# EAGLE design 12V - 5V Buck (1A) - LM3485 v2 (EAGLE 6.5.0)
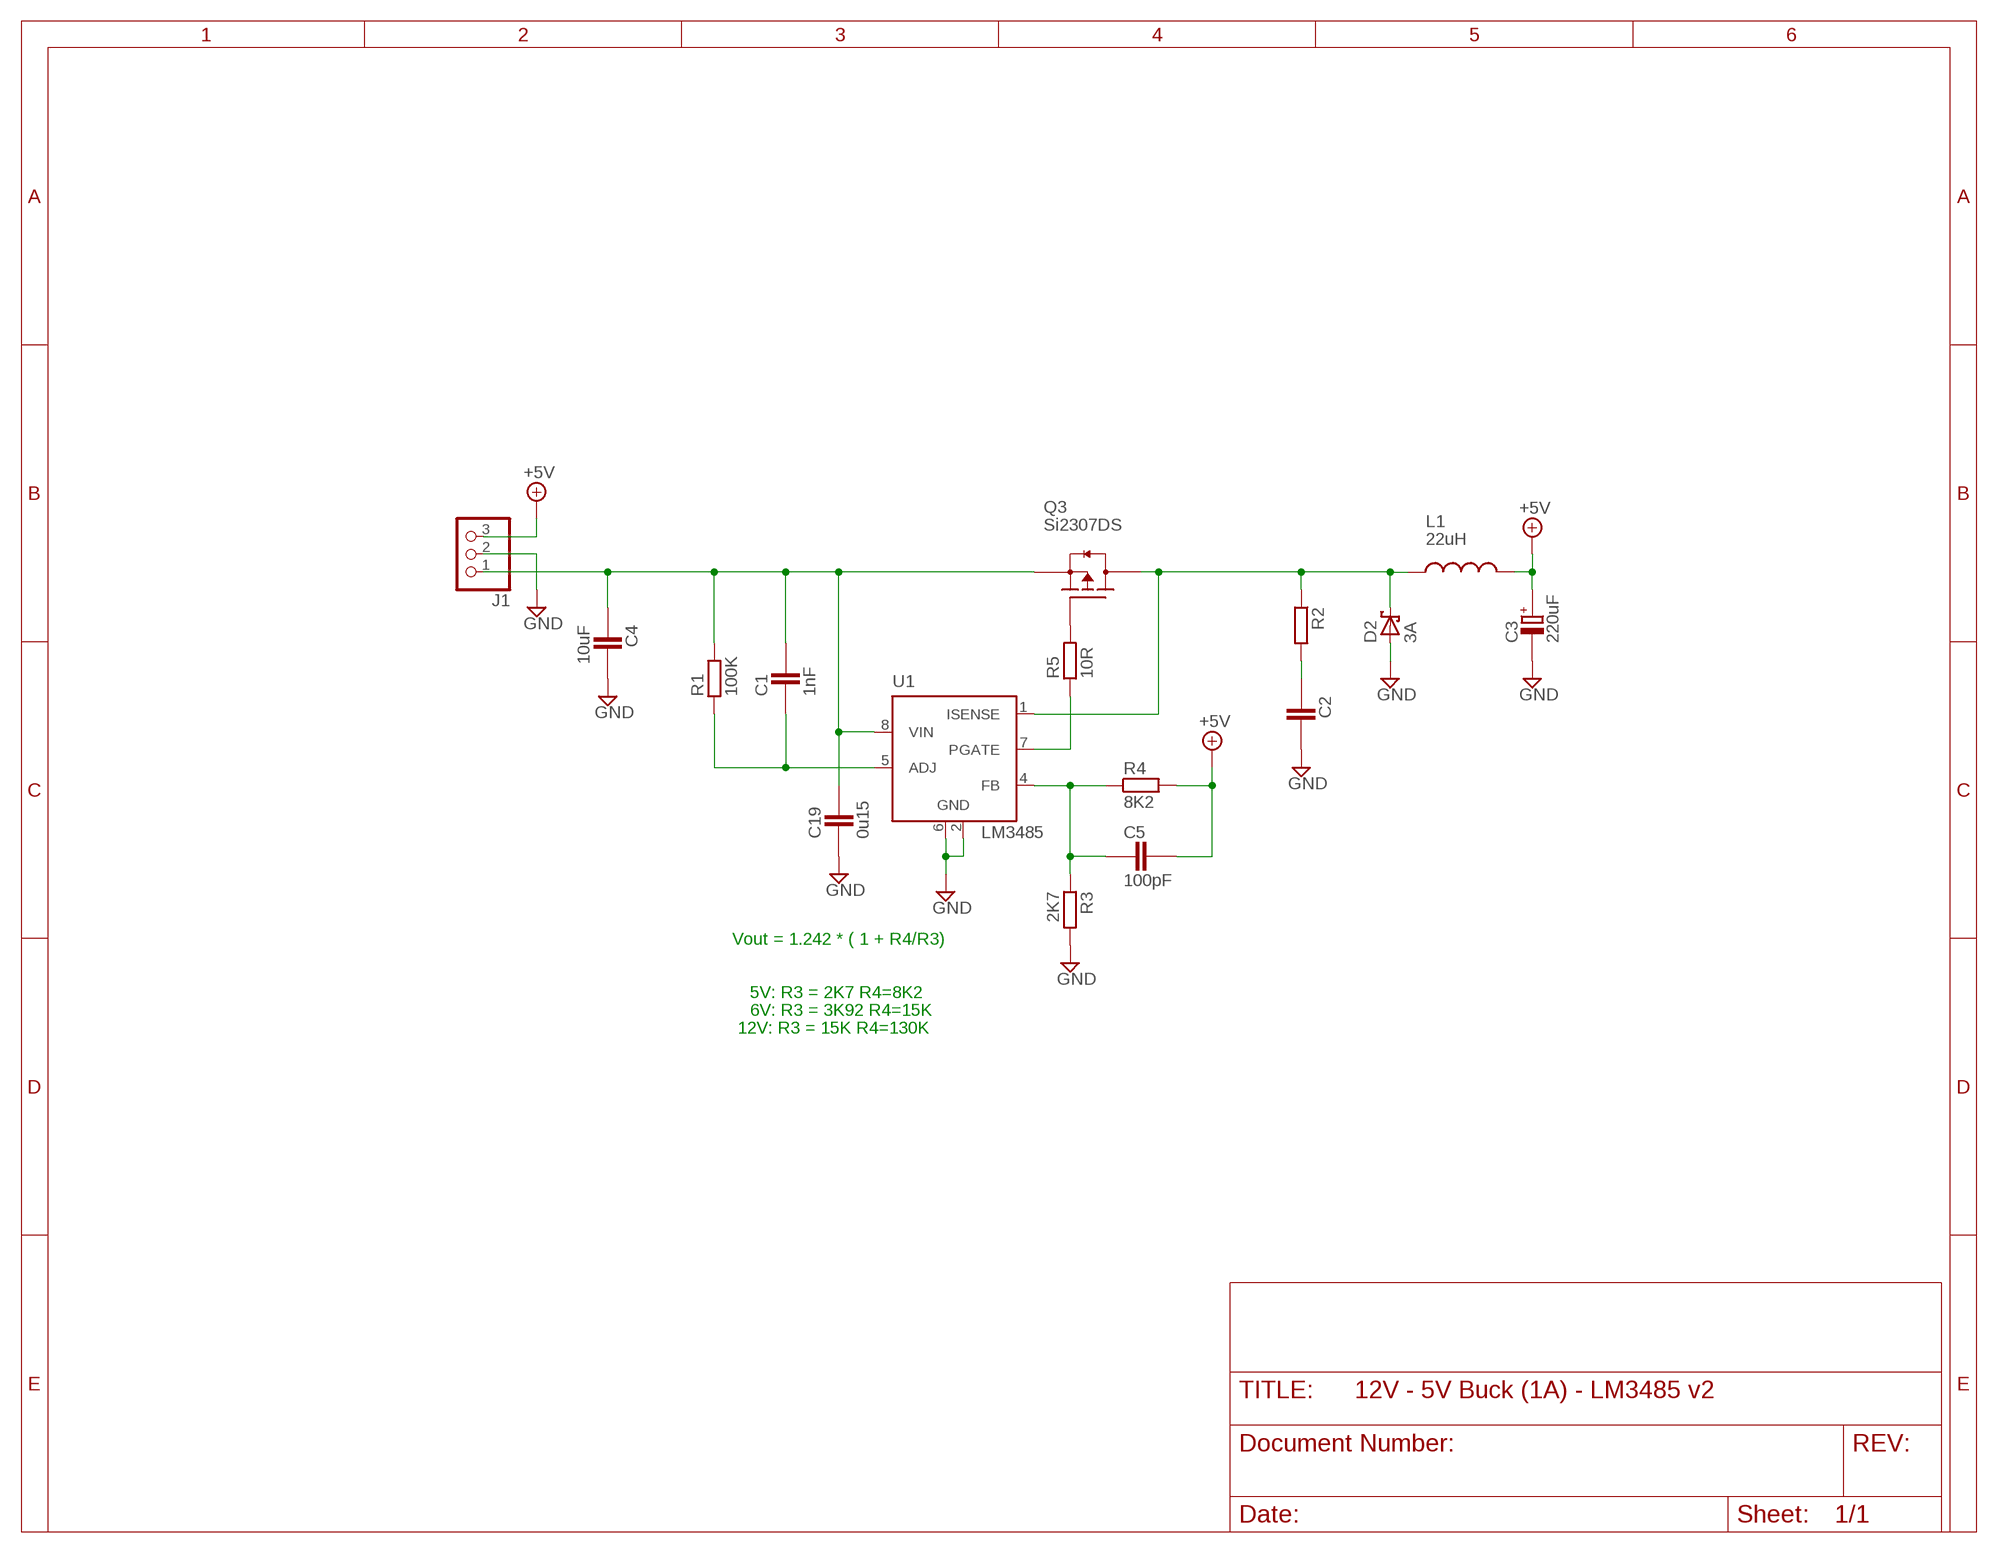
[diagram p0: schematic, sheet 1]

## Parts
C1  1nF  CAPACITOR_0805N  [CAP2012X70N]
C2  CAPACITOR_0805N  [CAP2012X70N]
C3  220uF  POLARISED_D_CASE  [CAPMP7343X310N]
C4  10uF  CAPACITOR_1210  [CAPC3225X168N]
C5  100pF  CAPACITOR_0805N  [CAP2012X70N]
C19  0u15  CAPACITOR_0603  [CAPC1608X92N]
D2  3A  SCHOTTKY_SMC  [DIOM7959X265N]
J1  PINHD-1X3  [1X03]
L1  22uH  DO3316P  [DO3316P]
Q3  Si2307DS  MOSFET-PCH_SOT-23  [SOT95P280X135-3N]
R1  100K  RESISTOR_0603  [RESC1608X55N]
R2  RESISTOR_0603  [RESC1608X55N]
R3  2K7  RESISTOR_0805  [RESC2012X70N]
R4  8K2  RESISTOR_0805  [RESC2012X70N]
R5  10R  RESISTOR_0603  [RESC1608X55N]
U1  LM3485  [MSOP08]

## Nets
+5V: C3.+ C5.2 J1.3 L1.2 R4.2
+12V: C1.2 C4.1 C19.2 J1.1 Q3.2(S) R1.2 U1.8(VIN)
GND: C2.2 C3.- C4.2 C19.1 D2.A J1.2 R3.2 U1.2(GND) U1.6(GND)
N$1: C5.1 R3.1 R4.1 U1.4(FB)
N$2: R5.1 U1.7(PGATE)
N$3: C1.1 R1.1 U1.5(ADJ)
N$4: C2.1 R2.2
N$6: Q3.1(G) R5.2
VO-L: D2.K L1.1 Q3.3(D) R2.1 U1.1(ISENSE)

## Notes on the sheet
- Vout = 1.242 * ( 1 + R4/R3)
- 5V: R3 = 2K7 R4=8K2
- 6V: R3 = 3K92 R4=15K
- 12V: R3 = 15K R4=130K

## Library data of the parts
C1 C2 C4 C5 C19 = ipc-7351-capacitor:CAPACITOR_
C3 = ipc-7351-capacitor:POLARISED_
D2 = ipc-7351-diode:SCHOTTKY_
J1 = Misc Conn:PINHD-1X3: PIN HEADER
L1 = Misc Inductors:DO3316P: COILCRAFT
Q3 = ipc-7351-transistor:MOSFET-PCH_
R1-R5 = ipc-7351-resistor:RESISTOR_
U1 = linear:LM3485: Hysteretic PFET Buck Controller Source: http://cache.national.com/ds/LM/LM3485.pdf

## Board
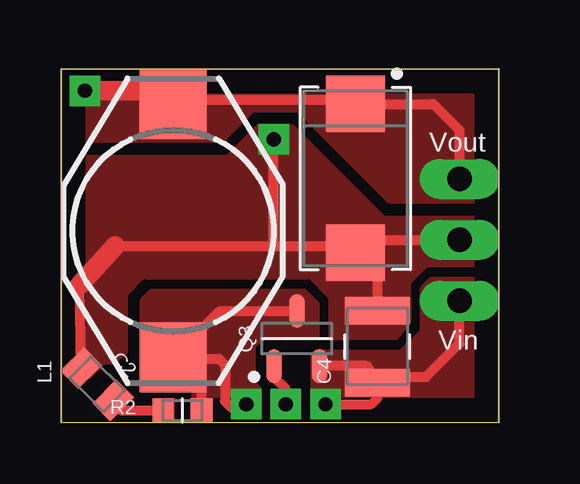
[diagram p1: board, top side]
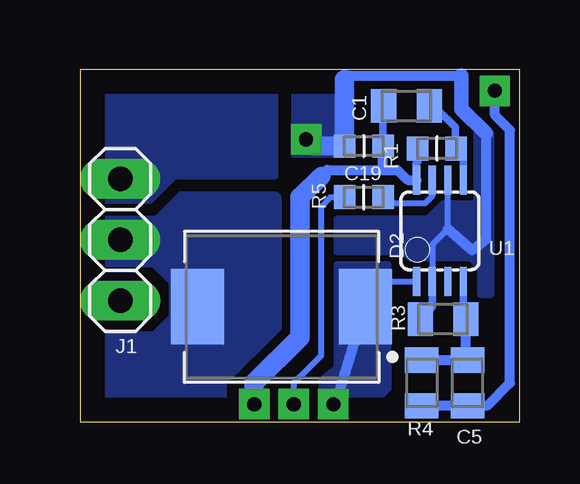
[diagram p2: board, bottom side, seen from below]

Size 18.29 x 14.73 mm. Coordinates in mm from the lower left corner, seen from the top.
Outline: 0,0 18.29,0 18.29,14.73 0,14.73 0,0
Copper layers (1*16): Top 0.035mm / dielectric 1.5mm / Bottom 0.035mm
Design rules "default": minimum track width 10mil, minimum drill 24mil, track to track 8mil, track to pad 8mil, pad to pad 8mil, via to via 8mil, smd to smd 8mil, copper to edge 40mil, drill to drill 8mil, minimum pad ring 10mil, minimum via ring 8mil, stop-mask expansion 4mil, vias tented up to drill 0mil, thermal gap 10mil

### Footprints (pad centres in the part's own frame; a part is rotated, then mirrored left to right if it is on the bottom)
CAP2012X70N = smd 1.05 x 1.4: 1 -0.95,0; 2 0.95,0
CAPMP7343X310N = smd 2.35 x 2.45: + -3.1,0; - 3.1,0
CAPC3225X168N = smd 1.15 x 2.7: 1 -1.5,0; 2 1.5,0
CAPC1608X92N = smd 0.9 x 0.95: 1 -0.8,0; 2 0.8,0
DIOM7959X265N = smd 2.2 x 3.15: A 3.5,0; K -3.5,0
1X03 = drill 1.016 pad 1.676 long: 1 -2.54,0; 2 0,0; 3 2.54,0
DO3316P = smd 2.92 x 2.79: 1 -5.28,0; 2 5.28,0
SOT95P280X135-3N = smd 1.4 x 0.65: 1 -1.15,0.95; 2 -1.15,-0.95; 3 1.15,0
RESC1608X55N = smd 0.9 x 1: 1 -0.8,0; 2 0.8,0
RESC2012X70N = smd 1.05 x 1.4: 1 -0.95,0; 2 0.95,0
MSOP08 = smd 0.3 x 1.2: 1 -0.976,-2.113; 2 -0.326,-2.113; 3 0.324,-2.113; 4 0.974,-2.113; 5 0.974,2.112; 6 0.324,2.112; 7 -0.326,2.112; 8 -0.976,2.112

### Placement (x,y rotation side)
C1  4.7,13.2 180 bottom
C2  1.52,1.6 135 top
C3  12.29,10.18 270 top
C4  13.21,3.17 90 top
C5  2.16,1.65 270 bottom
C19  6.48,11.53 0 bottom
D2  9.91,4.82 180 bottom
J1  16.64,7.61 90 bottom
L1  4.7,8 90 top
Q3  9.86,3.5 90 top
R1  3.43,11.42 180 bottom
R2  5.08,0.5 180 top
R3  3.17,4.31 180 bottom
R4  4.06,1.65 270 bottom
R5  6.48,9.39 180 bottom
U1  3.3,8 0 bottom

### Tracks (layer width: path | path; a pad name or v marks a point on that pad's centre or on a via)
+5V  (via drill 0.6 pad 1.27)
  Top 0.254: 4.83,13.46 4.64,13.46 4.64,13.84
  Top 0.406: L1.2 4.77,13.4 4.83,13.46 11.45,13.46 C3.+ 15.54,13.28 16.64,12.19 J1.3
  Top 0.813: v1.02,13.84 4.64,13.84
  Bottom 0.406: v1.02,13.84 1.02,12.82 0.38,12.19 0.38,1.65 1.33,0.7 C5.2 R4.2
  pour Top (no thermals): 0.13,14.6 0.13,11.81 6.73,11.81 8,13.08 9.91,13.08 13.72,9.27 17.78,9.27 18.16,9.65 18.16,14.6
  pour Bottom (no thermals): 18.16,14.6 18.16,9.65 17.78,9.27 15.37,9.27 14.35,10.28 10.16,10.28 10.16,14.6
+12V  (via drill 0.6 pad 1.27)
  Top 0.406: J1.1 16.64,3.3 15.24,1.9 13.23,1.9 C4.1 | Q3.2 12.78,2.35 C4.1 | v11.05,0.76 12.95,0.76 13.21,1.01 C4.1
  Bottom 0.305: R1.2 4.23,10.88 4.32,10.79 4.32,10.15 U1.8 | C19.2 5.68,13.17 C1.2
  Bottom 0.406: U1.8 4.66,10.11 5.08,10.54 5.71,10.54 | 8.26,10.28 8,10.54 5.71,10.54 | C19.2 5.68,10.57 5.71,10.54
  Bottom 0.762: 9.14,9.39 8.26,10.28
  Bottom 0.813: 9.14,9.39 9.14,3.55 11.05,1.65 v11.05,0.76
  pour Top (no thermals): 10.54,0.12 10.54,2.79 10.67,2.92 14.22,2.92 15.11,3.8 15.11,5.58 15.49,5.96 17.78,5.96 18.16,5.58 18.16,0.12
GND  (via drill 0.6 pad 1.27)
  Top 0.406: 12.73,7.33 C3.- 11.51,7.36 8.89,7.36 | 12.73,7.33 13.21,6.85 C4.2 | J1.2 13.01,7.61 12.73,7.33 | C2.2 0.8,5.74 | 2.29,7.36 8.89,7.36 | 8.89,7.36 v8.89,11.81
  Top 0.813: 0.8,5.74 2.29,7.36
  Bottom 0.254: U1.6 2.98,8.07 3.63,7.42 U1.2
  Bottom 0.305: U1.2 3.63,4.81 R3.2
  Bottom 0.406: 2.98,8.07 1.96,7.18 1.4,7.61 1.4,12.06 | 2.41,14.47 7.11,14.47 7.28,14.31
  Bottom 0.61: 1.4,12.06 2.41,13.08 2.41,14.47
  Bottom 0.813: 7.28,14.31 C19.1 8.57,11.55 v8.89,11.81
  pour Top (no thermals): 1.02,1.77 0.13,1.77 0.13,11.04 6.98,11.04 8.26,12.31 9.65,12.31 13.46,8.5 17.78,8.5 18.16,8.12 18.16,6.98 17.78,6.6 15.24,6.6 14.48,5.84 14.48,4.19 13.97,3.55 11.3,3.55 11.3,5.2 10.41,6.09 3.43,6.09 2.67,5.33 2.67,2.92 2.16,2.53 1.78,2.53
  pour Bottom (no thermals): 7.62,8.5 7.62,7.11 4.83,7.11 4.57,6.85 2.03,6.85 1.65,6.47 1.65,5.33 1.14,5.33 1.14,12.06 1.78,12.06 1.78,9.14 3.17,9.14 3.81,8.5
  pour Bottom (no thermals): 10.03,3.93 12.32,1.65 12.32,0.25 18.16,0.25 18.16,3.68 15.24,3.68 14.48,4.44 14.48,5.84 15.24,6.6 17.78,6.6 18.16,6.98 18.16,8.12 17.78,8.5 15.11,8.5 14.1,9.52 10.16,9.52 10.03,9.39
  pour Bottom (no thermals): 6.98,11.17 6.98,14.6 9.4,14.6 9.4,11.17
N$1
  Bottom 0.305: U1.4 2.33,4.42 R3.1
  Bottom 0.406: R4.1 C5.1 2.23,2.66 R3.1
N$2
  Bottom 0.254: U1.7 3.63,9.45 3.94,9.14 5.46,9.14 R5.1
N$3
  Bottom 0.305: U1.5 2.33,11.12 R1.1 2.67,11.46 2.67,12.31 3.43,13.08 C1.1
N$4
  Top 0.406: C2.1 2.27,0.77 2.54,0.5 R2.2
N$6  (via drill 0.6 pad 1.27)
  Top 0.406: Q3.1 8.91,1.89 9.4,1.39 v9.4,0.76
  Bottom 0.254: R5.2 7.87,9.39 8.26,9.01 8.26,2.79 9.4,1.65 v9.4,0.76
VO-L  (via drill 0.6 pad 1.27)
  Top 0.406: R2.1 5.88,2.37 5.59,2.66 | 5.59,2.66 4.75,2.66 L1.1 6.63,4.65 Q3.3 | v7.75,0.76 7.11,0.63 6.86,0.88 6.86,2.41 6.6,2.66 5.59,2.66
  Bottom 0.254: U1.1 5.73,5.88 D2.K
  Bottom 0.406: D2.K 7.56,1.07 v7.75,0.76
  pour Top (no thermals): 3.43,1.52 3.43,5.08 3.81,5.46 10.16,5.46 10.67,4.95 10.67,3.55 8.38,3.55 8,3.17 8,1.65 8.26,1.39 8.26,0.12 5.59,0.12 5.59,1.39 3.56,1.39
  pour Bottom (no thermals): 5.46,6.6 7.62,6.6 7.62,2.28 8.26,1.77 8.26,0.25 6.6,0.25 5.46,1.39

### Text on the board
tPlace: Vout | Vin